# EAGLE design Team Scio Final Rev 3 (EAGLE 7.1.0)
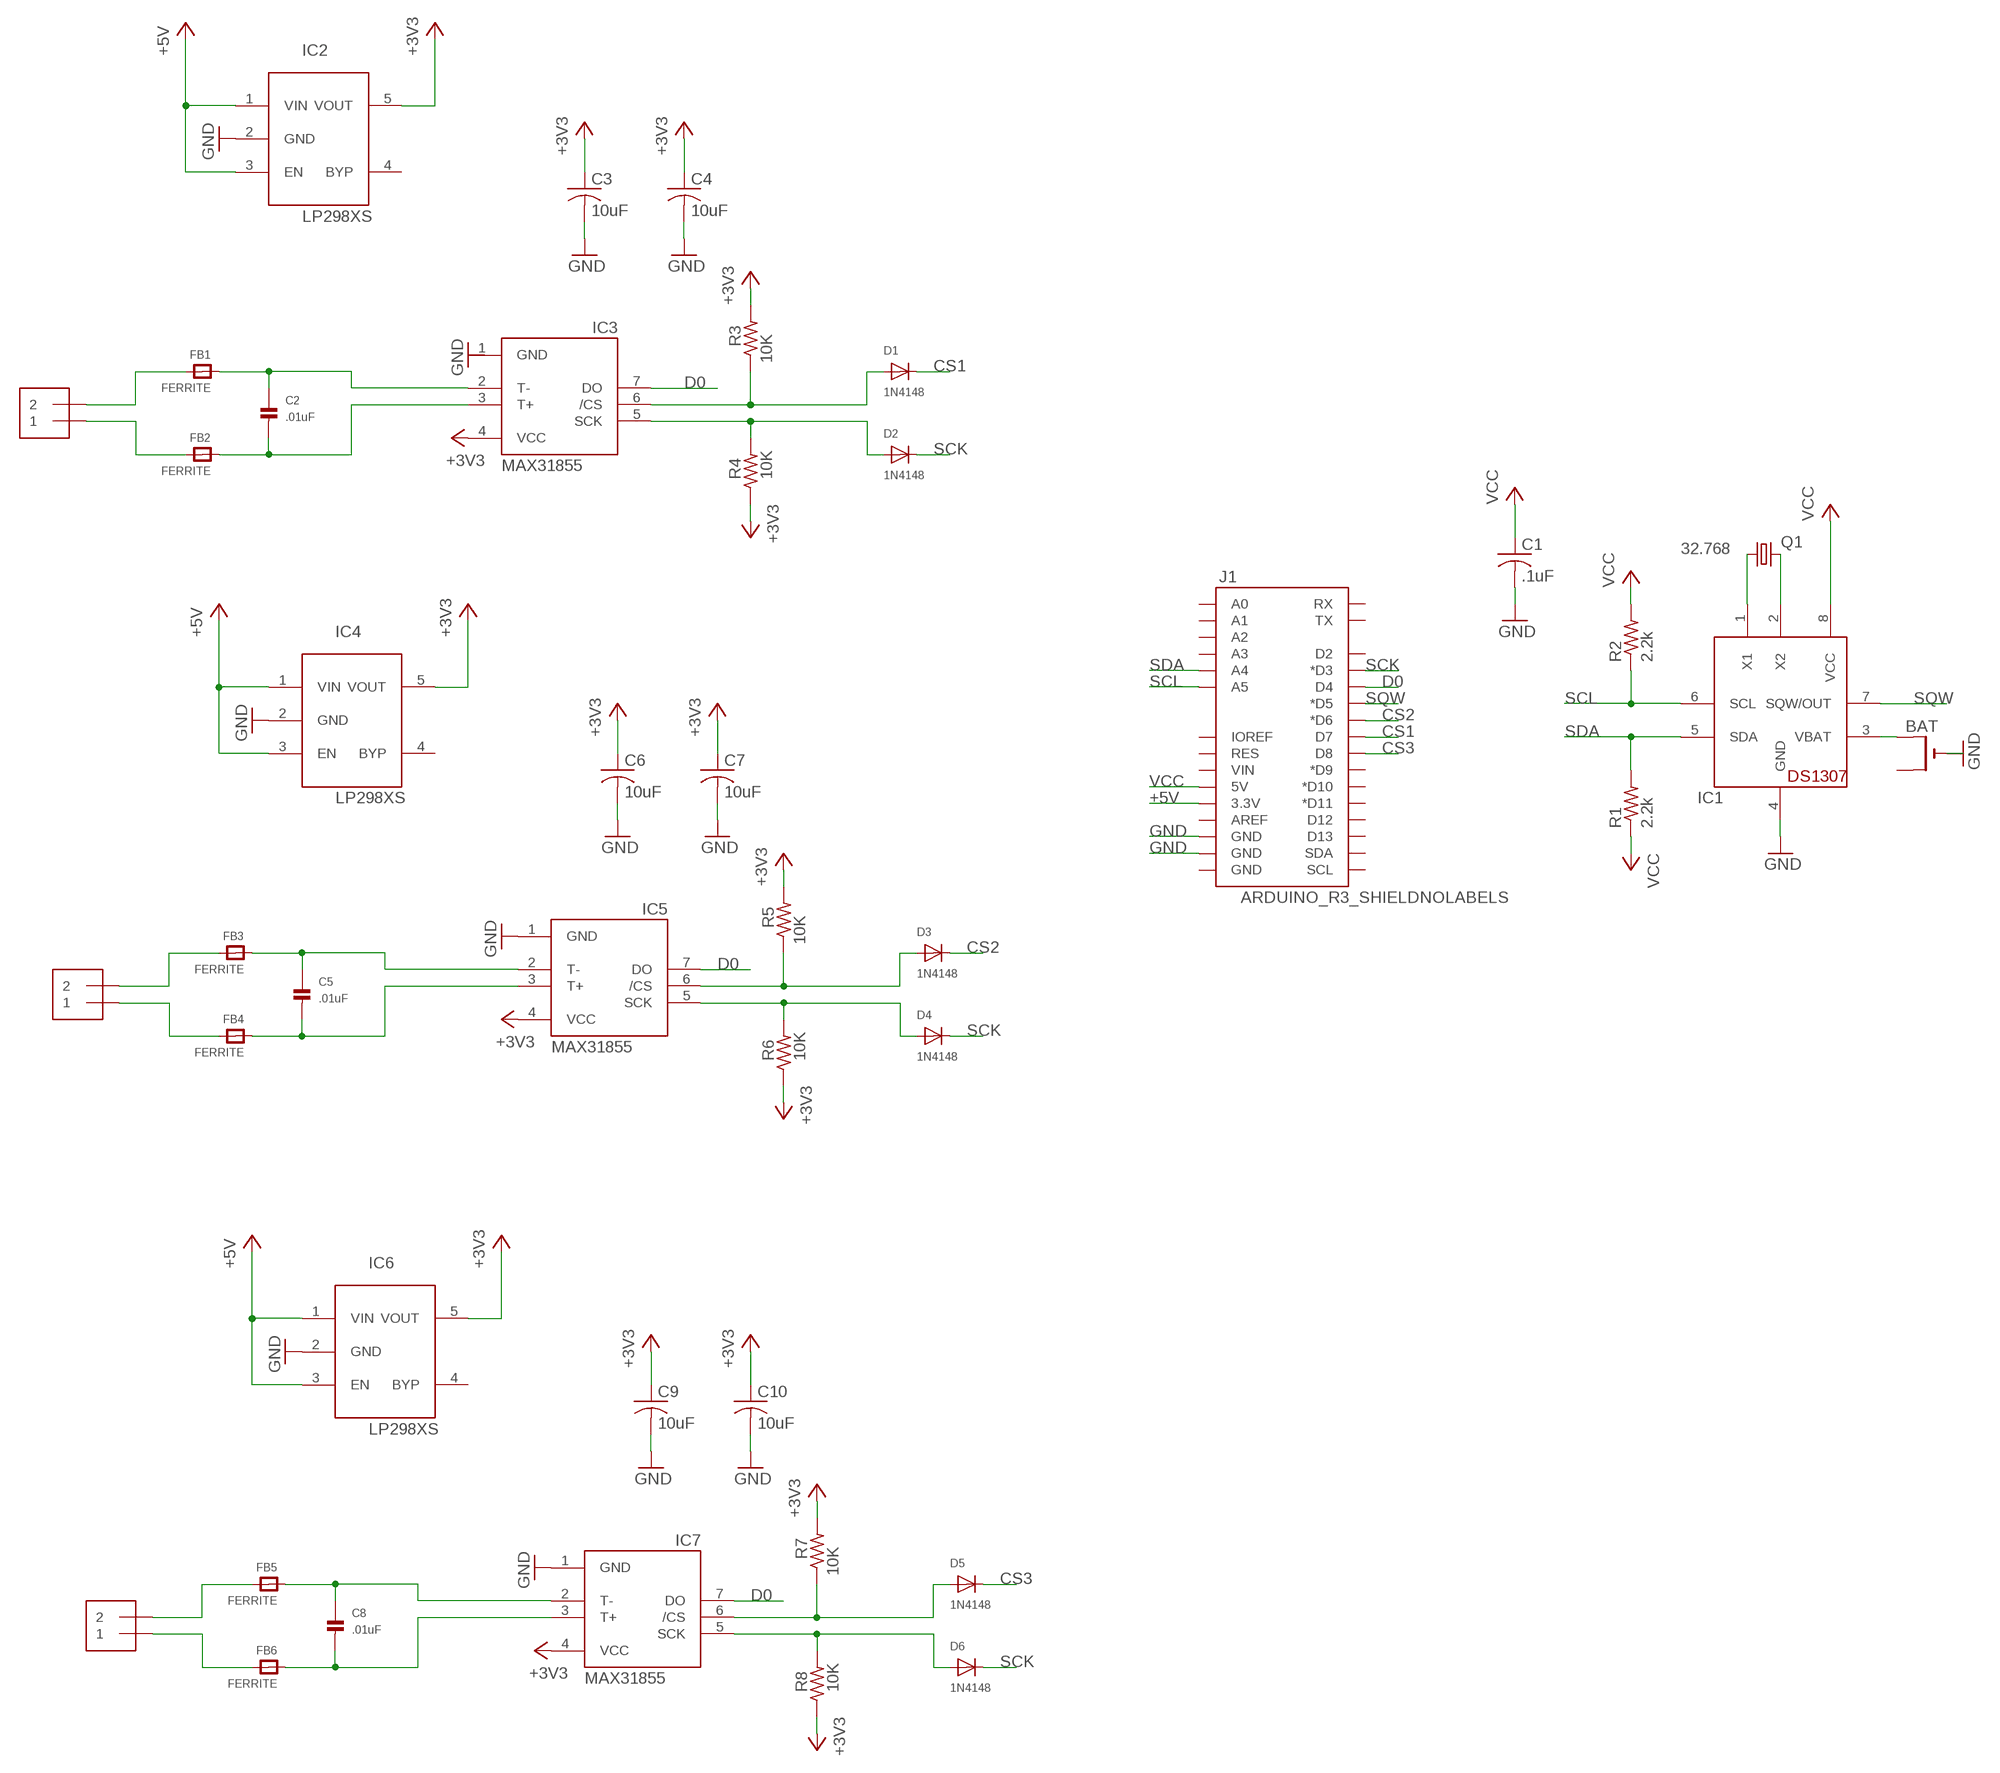
[diagram p0: schematic, sheet 1]

## Parts
C1  .1uF  C-US025-025X050  [C025-025X050]
C2  .01uF  CAP_CERAMIC0805  [0805]
C3  10uF  C-USC0805K  [C0805K]
C4  10uF  C-USC0805K  [C0805K]
C5  .01uF  CAP_CERAMIC0805  [0805]
C6  10uF  C-USC0805K  [C0805K]
C7  10uF  C-USC0805K  [C0805K]
C8  .01uF  CAP_CERAMIC0805  [0805]
C9  10uF  C-USC0805K  [C0805K]
C10  10uF  C-USC0805K  [C0805K]
D1  1N4148  DIODESOD-323F  [SOD-323F]
D2  1N4148  DIODESOD-323F  [SOD-323F]
D3  1N4148  DIODESOD-323F  [SOD-323F]
D4  1N4148  DIODESOD-323F  [SOD-323F]
D5  1N4148  DIODESOD-323F  [SOD-323F]
D6  1N4148  DIODESOD-323F  [SOD-323F]
FB1  FERRITE  FERRITE0805  [0805]
FB2  FERRITE  FERRITE0805  [0805]
FB3  FERRITE  FERRITE0805  [0805]
FB4  FERRITE  FERRITE0805  [0805]
FB5  FERRITE  FERRITE0805  [0805]
FB6  FERRITE  FERRITE0805  [0805]
IC1  DS1307  [DIL08]
IC2  LP298XS  [SOT23-5L]
IC3  MAX31855  MAX6675  [SO08]
IC4  LP298XS  [SOT23-5L]
IC5  MAX31855  MAX6675  [SO08]
IC6  LP298XS  [SOT23-5L]
IC7  MAX31855  MAX6675  [SO08]
J1  ARDUINO_R3_SHIELDNOLABELS  [UNO_R3_SHIELD_NOLABELS]
J2  J1  1X2-3.5MM  [1X2-3.5MM]
J3  1X2-3.5MM  [1X2-3.5MM]
J4  1X2-3.5MM  [1X2-3.5MM]
Q1  32.768  CRYSTALTC38H  [TC38H]
R1  2.2k  R-US_M1206  [M1206]
R2  2.2k  R-US_M1206  [M1206]
R3  10K  R-US_M1206  [M1206]
R4  10K  R-US_M1206  [M1206]
R5  10K  R-US_M1206  [M1206]
R6  10K  R-US_M1206  [M1206]
R7  10K  R-US_M1206  [M1206]
R8  10K  R-US_M1206  [M1206]
RTC  BAT  CR1220THM  [CR1220-THM]

## Nets
+3V3: C3.1 C4.1 C6.1 C7.1 C9.1 C10.1 IC2.5(VOUT) IC3.4(VCC) IC4.5(VOUT) IC5.4(VCC) IC6.5(VOUT) IC7.4(VCC) R3.2 R4.1 R5.2 R6.1 R7.2 R8.1
+5V: IC2.1(VIN) IC2.3(EN) IC4.1(VIN) IC4.3(EN) IC6.1(VIN) IC6.3(EN) J1.3.3V
CS1: D1.C J1.D7
CS2: D3.C J1.D6(*D6)
CS3: D5.C J1.D8
D0: IC3.7(DO) IC5.7(DO) IC7.7(DO) J1.D4
GND: C1.2 C3.2 C4.2 C6.2 C7.2 C9.2 C10.2 IC1.4(GND) IC2.2(GND) IC4.2(GND) IC5.1(GND) IC6.2(GND) IC7.1(GND) J1.GND@1(GND) J1.GND@2(GND) RTC.-
N$1: IC1.3(VBAT) RTC.+2(+1)
N$2: IC1.1(X1) Q1.1
N$3: IC1.2(X2) Q1.2
N$4: FB1.2 J2.2
N$5: FB2.2 J2.1
N$6: C2.1 FB1.1 IC3.2(T-)
N$7: C2.2 FB2.1 IC3.3(T+)
N$8: D1.A IC3.6(/CS) R3.1
N$9: D2.A IC3.5(SCK) R4.2
N$10: FB3.2 J3.2
N$11: FB4.2 J3.1
N$12: C5.1 FB3.1 IC5.2(T-)
N$13: C5.2 FB4.1 IC5.3(T+)
N$14: D3.A IC5.6(/CS) R5.1
N$15: D4.A IC5.5(SCK) R6.2
N$16: FB5.2 J4.2
N$17: FB6.2 J4.1
N$18: C8.1 FB5.1 IC7.2(T-)
N$19: C8.2 FB6.1 IC7.3(T+)
N$20: D5.A IC7.6(/CS) R7.1
N$21: D6.A IC7.5(SCK) R8.2
SCK: D2.C D4.C D6.C J1.D3(*D3)
SCL: IC1.6(SCL) J1.A5 R2.1
SDA: IC1.5(SDA) J1.A4 R1.2
SQW: IC1.7(SQW/OUT) J1.D5(*D5)
VCC: C1.1 IC1.8(VCC) J1.5V R1.1 R2.2
Unconnected: IC2.4(BYP) IC4.4(BYP) IC6.4(BYP) J1.A0 J1.A1 J1.A2 J1.A3 J1.AREF J1.D2 J1.D9(*D9) J1.D10(*D10) J1.D11(*D11) J1.D12 J1.D13 J1.GND@0(GND) J1.IOREF J1.RES J1.RX J1.SCL J1.SDA J1.TX J1.VIN RTC.+1(+)

## Power pins joined to a net without a drawn wire
GND: IC3.1(GND)

## Library data of the parts
C1 C3 C4 C6 C7 C9 C10 = adafruit:C-US: CAPACITOR, American symbol
C2 C5 C8 = microbuilder:CAP_CERAMIC: Ceramic Capacitors 0402 - 0402 Surface Mount Capacitors 16pF 50V 5% [Digikey: 445-4899-2-ND] 18pF 50V 5% [Digikey: 490-1281-2-ND] 22pF 50V 5% [Digikey: 490-1283-2-ND] 68pF 50V 5% [Digikey: 490-1289-2-ND] 0.1uF 10V 10% [Digikey: 490-1318-2-ND] 1.0uF 6.3V 10% [Digikey: 490-1320-2-ND] 0603 - 0603 Surface Mount Capacitors 16 pF 50V 5% [Digikey: 445-5051-2-ND] 22 pF 50V [Digikey: PCC220ACVTR-ND] 33 pF 50V 5% [Digikey: 490-1415-1-ND] 56pF 50V 5% [Digikey: 490-1421-1-ND] 220pF 50V 5% [Digikey: 445-1285-1-ND] 680 pF 50V 2200 pF 50V 5% C0G [Digikey: 445-1297-1-ND] 5600 pF 100V 5% X7R [Digikey: 478-3711-1-ND] 0.1 µF 25V 10% [Digikey: PCC2277TR-ND] 0.22 µF 16V 10% X7R [Digikey: 445-1318-1-ND] 1.0 µF 25V 10% [Digikey: 445-5146-2-ND] 0603 - RF Specific 3pF 250V +/-0.1pF RF [Digikey: 712-1347-1-ND] 18 pF 250V 5% [Digikey: 478-3505-1-ND or 712-1322-1-ND] 56 pF 250V 5% C0G RF [Digikey: 490-4867-1-ND] 68 pF 250V RF [Digikey: 490-4868-1-ND] 0805 - 0805 Surface Mount Capacitors 220 pF 250V 2% RF Ceramic Capacitor [Digikey: 712-1398-1-ND] 1000 pF 50V 2% NP0 Ceramic Capacitor [Digikey: 478-3760-1-ND] 0.1 µF 25V 10% Ceramic Capacitor [Digikey: PCC1828TR-ND] 1.0 µF 16V 10% Ceramic Capacitor[Digikey: 490-1691-2-ND] 10.0 µF 10V 10% Ceramic Capacitor[Digikey: 709-1228-1-ND] 10.0 uF 16V 10% Ceramic Capacitor [Digikey: 478-5165-2-ND] 47 uF 6.3V 20% Ceramic Capacitor [Digikey: 587-1779-1-ND or 399-5506-1-ND] 1206 - 1206 Surface Mount Capacitors 47uF 10V 20% Ceramic Capacitor [Digikey: 490-5528-1-ND or 399-5508-1-ND or 445-6010-1-ND] 100uF 6.3V -20%, +80% Y5V Ceramic Capacitor (Digikey: 490-4512-1-ND, Mouser: 81-GRM31CF50J107ZE1L)
D1-D6 = adafruit:DIODE: Diode SMADIODE - SMA Surface Mount Package 20V 1A Schottky Diode Digikey: 641-1014-6-ND DO-1N4148 - Through Hole Small Current Diode SOD-123 20V 1 A (.5mV Vf) Schottky Diode - Digikey: MBRX120TPMSCT-ND SOD-323 10V 570mA (.38mV Vf, 3ns) Schottky Diode - Digikey: ZLLS410CT-ND SOD-523 30V 30mA Schottky Diode (RB751S-40TE61) - Digikey: RB751S-40TE61CT-ND SOT23-R/W - SOT23 Package (R = Solder Paste/Reflow Ovens, W = Hand-Soldering) BAT54Film 40V 300mA - Digikey: 497-7162-1-ND
FB1-FB6 = microbuilder:FERRITE: Ferrite Bead 0603 MMZ1608B121C - 120 Ohm @ 100MHz, 600mA, 0.15 Ohm DC Resistance - Digikey: 445-2164-1-ND BK1608HW121-T - 120 Ohm, 600mA Ferrite Chip - Digikey: 587-1876-2-ND 0805 HZ0805B272R-10 - 2.7K Ohm @ 100MHz, 200mA, 0.8 Ohm DC Resistance - Digikey: 240-2504-1-ND (see also Murata BLM21BD272SN1L) MMZ2012Y152B - 1.5K Ohm @ 100MHz, 500mA, 0.4 Ohm DC Resistance - Digikey: 445-1560-1-ND - Mainly for high frequency (80-400MHz) MMZ2012R102A - 1K Ohm @ 100MHz, 500mA, 0.3 Ohm DC Resistance - Digikey: 445-1555-2-ND - More general purpose (10-200MHz)
IC1 = adafruit:DS1307: DS1307 Real time clock (RTC) with battery backup ability. Talk to it via i2c
IC2 IC4 IC6 = adafruit:LP298X
IC3 IC5 IC7 = adafruit:MAX6675
J1 = SparkFun-Boards:ARDUINO_R3_SHIELD: Shield form compatible with the Arduino Uno R3.
J2-J4 = adafruit:1X2: 3.5mm Terminal block http://www.ladyada.net/library/pcb/eaglelibrary.html
Q1 = crystal:CRYSTAL: CRYSTAL; OC_FARNELL: unknown; OC_NEWARK: unknown
R1 R2 = adafruit:R-US_: RESISTOR, American symbol
R3-R8 = resistor:R-US_: RESISTOR, American symbol
RTC = adafruit:CR1220: CR1216/CR1220/CR1225 12mm 3V lithium coin cell Great for battery packup. Both SMT and THM holders. Note the THM package has the ground pads on both sides of the PCB so that the masks are the same - this reduces the cost

## Net classes
0 default: width 0.305 mm, drill 0.508 mm, clearance 0.254 mm

## Board
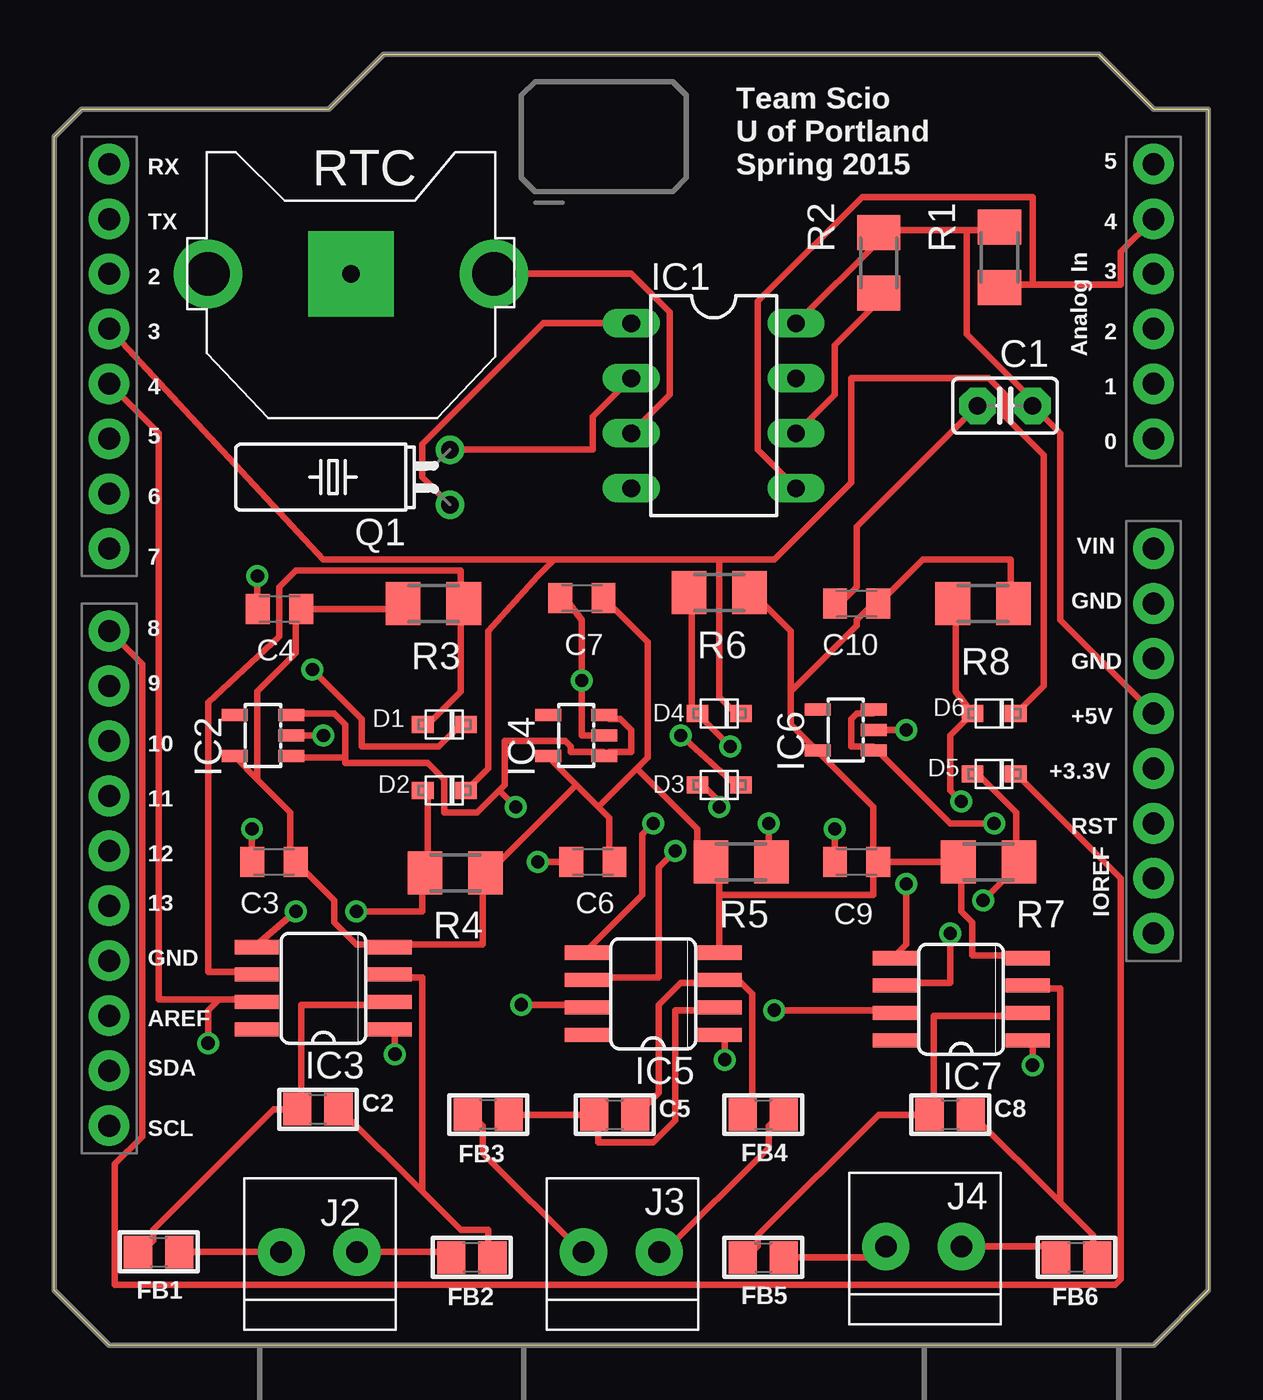
[diagram p1: board, top side]
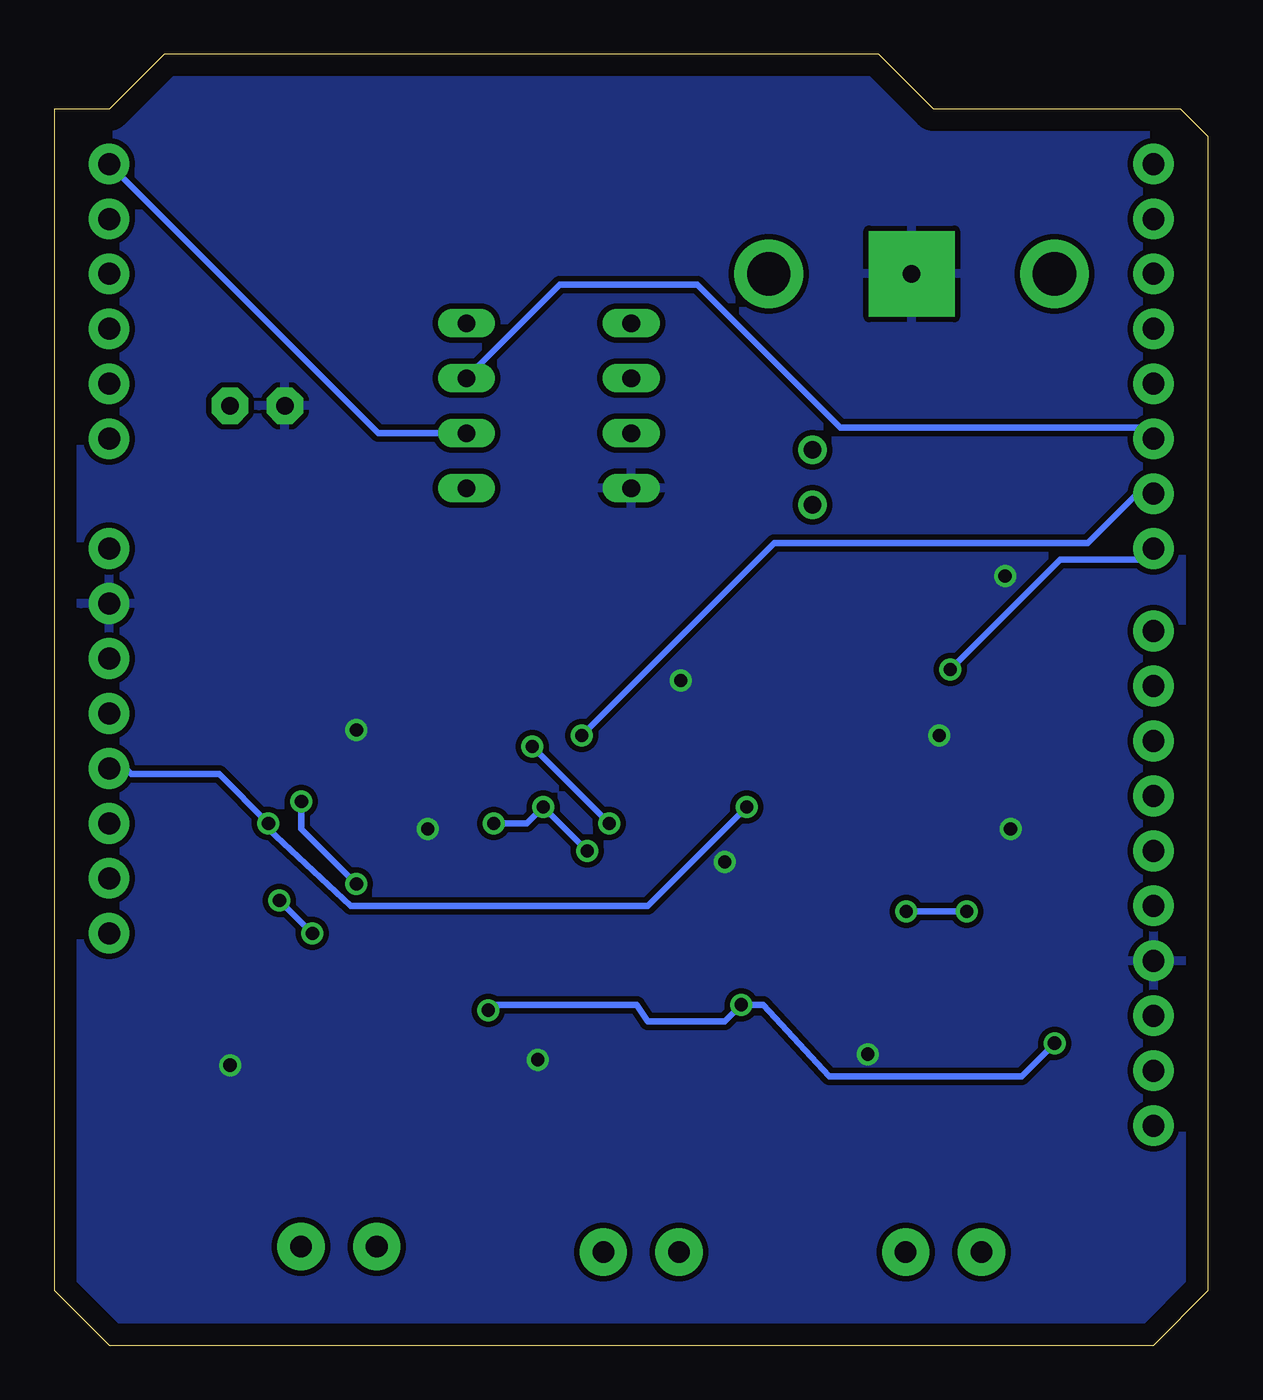
[diagram p2: board, bottom side, seen from below]

Size 53.34 x 59.69 mm. Coordinates in mm from the lower left corner, seen from the top.
Outline: 0,55.88 1.27,57.15 12.7,57.15 15.24,59.69 48.26,59.69 50.8,57.15 53.34,57.15 53.34,2.54 50.8,0 2.54,0 0,2.54 0,55.88
Copper layers (1*16): Top 0.035mm / dielectric 1.5mm / Bottom 0.035mm
Design rules "default": minimum track width 10mil, minimum drill 24mil, track to track 8mil, track to pad 8mil, pad to pad 8mil, via to via 8mil, smd to smd 8mil, copper to edge 40mil, drill to drill 8mil, minimum pad ring 10mil, minimum via ring 8mil, stop-mask expansion 4mil, vias tented up to drill 0mil, thermal gap 10mil

### Footprints (pad centres in the part's own frame; a part is rotated, then mirrored left to right if it is on the bottom)
C025-025X050 = drill 0.813 pad 1.676 octagon: 1 -1.27,0; 2 1.27,0
0805 = smd 1.3 x 1.5: 1 -0.95,0; 2 0.95,0
C0805K = smd 1.1 x 1.4: 1 -1,0; 2 1,0
SOD-323F = smd 1 x 0.8: A -1,0; C 1,0
DIL08 = drill 0.813 long: 1 -3.81,-3.81; 2 -1.27,-3.81; 3 1.27,-3.81; 4 3.81,-3.81; 5 3.81,3.81; 6 1.27,3.81; 7 -1.27,3.81; 8 -3.81,3.81
SOT23-5L = smd 0.55 x 1.2: 1 -0.95,-1.3; 2 0,-1.3; 3 0.95,-1.3; 4 0.95,1.3; 5 -0.95,1.3
SO08 = smd 0.66 x 2.032: 1 -1.905,-3.073; 2 -0.635,-3.073; 3 0.635,-3.073; 4 1.905,-3.073; 5 1.905,3.073; 6 0.635,3.073; 7 -0.635,3.073; 8 -1.905,3.073
UNO_R3_SHIELD_NOLABELS = drill 1.016 pad 1.88: 3.3V 50.8,26.67; 5V 50.8,29.21; A0 50.8,41.91; A1 50.8,44.45; A2 50.8,46.99; A3 50.8,49.53; A4 50.8,52.07; A5 50.8,54.61; AREF 2.54,15.24; D2 2.54,49.53; D3 2.54,46.99; D4 2.54,44.45; D5 2.54,41.91; D6 2.54,39.37; D7 2.54,36.83; D8 2.54,33.02; D9 2.54,30.48; D10 2.54,27.94; D11 2.54,25.4; D12 2.54,22.86; D13 2.54,20.32; GND@0 50.8,31.75; GND@1 50.8,34.29; GND@2 2.54,17.78; IOREF 50.8,21.59; NC 50.8,19.05; RES 50.8,24.13; RX 2.54,54.61; SCL 2.54,10.16; SDA 2.54,12.7; TX 2.54,52.07; VIN 50.8,36.83
1X2-3.5MM = drill 1 pad 2.184: 1 1.8,0; 2 -1.7,0
TC38H = drill 0.813: 1 -1.27,0; 2 1.27,0
M1206 = smd 1.6 x 2: 1 -1.4,0; 2 1.4,0
CR1220-THM = drill 2 pad 3.175: +1 -6.604,0; +2 6.604,0 | drill 0.8 pad 3.962 square: - 0,0

### Placement (x,y rotation side)
C1  43.94,43.43 180 top
C2  12.19,10.92 0 top
C3  10.16,22.35 180 top
C4  10.41,34.04 180 top
C5  25.91,10.67 0 top
C6  24.89,22.35 180 top
C7  24.38,34.54 180 top
C8  41.4,10.67 0 top
C9  37.08,22.35 180 top
C10  37.08,34.29 180 top
D1  18.03,28.7 0 top
D2  18.03,25.65 0 top
D3  30.73,25.91 0 top
D4  30.73,29.21 0 top
D5  43.43,26.42 0 top
D6  43.43,29.21 0 top
FB1  4.83,4.32 0 top
FB2  19.3,4.06 180 top
FB3  20.07,10.67 180 top
FB4  32.77,10.67 0 top
FB5  32.77,4.06 0 top
FB6  47.24,4.06 180 top
IC1  30.48,43.43 270 top
IC2  9.65,28.19 90 top
IC3  12.45,16.51 90 top
IC4  24.13,28.19 90 top
IC5  27.69,16.26 90 top
IC6  36.58,28.45 90 top
IC7  41.91,16 90 top
J1  0,0 0 top
J2  12.19,4.32 0 top
J3  26.16,4.32 0 top
J4  40.13,4.57 0 top
Q1  18.29,40.13 90 top
R1  43.69,50.29 270 top
R2  38.1,50.04 90 top
R3  17.53,34.29 180 top
R4  18.54,21.84 180 top
R5  31.75,22.35 180 top
R6  30.73,34.8 180 top
R7  43.18,22.35 180 top
R8  42.93,34.29 180 top
RTC  13.72,49.53 0 top

### Tracks (layer width: path | path; a pad name or v marks a point on that pad's centre or on a via)
+3V3
  Top 0.305: R8.1 44.2,34.29 44.2,36.32 40.13,36.32 38.1,34.29 C10.1 37.85,34.29 37.08,33.53 37.08,33.27 34.04,30.23 | 30.73,20.83 30.73,18.29 IC5.4 | 30.73,20.83 30.73,22.1 30.48,22.35 R5.2 30.23,22.35 29.72,22.86 29.72,23.88 26.92,26.67 | 37.85,22.35 37.85,24.89 35.31,27.43 IC6.5 35.05,27.69 34.04,28.7 34.04,30.23 | 34.04,30.23 34.04,33.02 32.26,34.8 R6.1 | IC7.4 44.96,18.03 42.42,18.03 42.42,19.56 41.91,20.07 41.91,22.35 R7.2 C9.1 37.85,22.35 | 30.73,20.83 37.85,20.83 37.85,22.35 | R3.2 16,34.29 16,34.04 C4.1 11.18,34.04 11.18,32 9.4,30.23 9.4,26.16 | 9.4,26.16 10.92,24.64 10.92,22.35 C3.1 11.18,22.35 12.95,20.57 12.95,19.56 13.97,18.54 15.49,18.54 IC3.4 15.75,18.54 19.81,18.54 19.81,21.84 R4.1 20.07,21.84 24.13,25.91 | 9.4,26.16 8.38,27.18 IC2.5 | 25.15,24.89 25.65,24.38 25.65,22.35 C6.1 | 25.15,24.89 24.13,25.91 | 24.13,25.91 22.86,27.18 IC4.5 | 25.15,24.89 26.92,26.67 | 26.92,26.67 27.43,27.18 27.43,32.51 25.4,34.54 C7.1
+5V  (via drill 0.61)
  Top 0.305: IC4.3 25.65,28.96 26.16,28.96 26.67,28.45 26.67,27.43 25.65,27.43 IC4.1 25.4,27.43 23.88,27.43 23.88,27.69 23.62,27.94 20.83,27.94 20.83,25.91 20.57,25.65 | 13.46,27.18 11.18,27.18 IC2.1 | 13.46,27.18 13.46,28.7 12.95,29.21 11.18,29.21 IC2.3 | 20.57,25.65 19.56,24.64 18.03,24.64 18.03,26.16 17.27,26.92 13.46,26.92 13.46,27.18 | IC6.3 37.85,29.21 37.08,29.21 36.83,28.96 36.83,27.69 37.85,27.69 IC6.1 38.1,27.43 41.4,24.13 v43.43,24.13 | v21.34,24.89 20.57,25.65
  Bottom 0.305: J1.3.3V 50.04,26.67 49.78,26.42 45.72,26.42 v43.43,24.13 43.43,23.88 39.62,20.32 25.91,20.32 v21.34,24.89
CS1  (via drill 0.61)
  Top 0.305: v11.94,31.24 14.22,28.96 14.22,27.69 17.78,27.69 18.8,28.7 D1.C
  Bottom 0.305: v11.94,31.24 6.86,36.32 3.05,36.32 J1.D7
CS2  (via drill 0.61)
  Top 0.305: v28.96,28.19 31.5,25.91 D3.C
  Bottom 0.305: v28.96,28.19 20.07,37.08 5.59,37.08 3.3,39.37 J1.D6
CS3
  Top 0.305: J1.D8 4.06,31.5 4.06,9.65 2.79,8.38 2.79,2.79 49.02,2.79 49.28,3.05 49.28,21.59 44.45,26.42 D5.C
D0  (via drill 0.61)
  Top 0.305: v33.27,15.49 38.61,15.49 IC7.7 | 24.64,15.75 IC5.7 24.61,15.75 v21.59,15.75 | 7.62,16 4.83,16 4.83,42.16 J1.D4 | 7.62,16 9.14,16 IC3.7 9.4,16 10.16,16 | v7.11,13.97 7.11,15.49 7.62,16
  Bottom 0.305: v33.27,15.49 33.02,15.75 26.42,15.75 25.91,14.99 22.35,14.99 v21.59,15.75 20.57,15.75 17.53,12.45 8.64,12.45 v7.11,13.97
GND  (via drill 0.61)
  Top 0.305: IC4.2 24.38,28.19 v24.38,30.73 24.38,33.53 23.62,34.54 C7.2 | v12.45,28.19 IC2.2 | v39.37,28.45 IC6.2 | v9.14,23.88 9.14,22.35 C3.2 | v9.4,35.56 9.4,34.04 C4.2 | v22.35,22.35 C6.2 | v36.07,23.88 36.07,22.35 C9.2 | C1.2 37.08,37.85 37.08,35.05 36.32,34.29 C10.2 | v15.75,13.46 15.75,14.48 IC3.1 | v30.99,13.21 30.99,14.22 IC5.1 | v45.21,12.95 45.21,13.97 IC7.1
  pour Bottom: -1.27,61.21 53.85,61.21 54.61,-2.29 -1.78,-2.29
N$1
  Top 0.305: IC1.3 28.45,43.94 28.45,47.75 26.67,49.53 RTC.+2
N$2
  Top 0.305: Q1.1 17.02,40.13 17.02,41.66 22.61,47.24 IC1.1
N$3
  Top 0.305: Q1.2 24.89,41.4 24.89,42.93 IC1.2
N$4
  Top 0.305: J2.2 FB1.2
N$5
  Top 0.305: 18.1,4.32 FB2.2 18.03,4.32 J2.1
N$6
  Top 0.305: FB1.1 4.06,4.32 4.57,4.83 4.57,5.33 10.16,10.92 C2.1 11.43,10.92 11.43,15.75 15.49,15.75 IC3.2
N$7
  Top 0.305: 17.02,7.11 18.8,5.33 20.07,5.33 20.07,4.06 FB2.1 | 17.02,7.11 13.21,10.92 C2.2 | 17.02,7.11 17.02,17.02 15.75,17.02 IC3.3
N$8
  Top 0.305: 18.8,34.29 18.8,30.23 17.27,28.7 D1.A | 18.8,34.29 18.8,35.81 11.18,35.81 10.41,35.05 10.41,32.77 7.11,29.72 7.11,17.27 9.14,17.27 IC3.6 | 18.8,34.29 R3.1
N$9  (via drill 0.61)
  Top 0.305: D2.A 17.27,25.65 17.27,21.84 R4.2 17.02,21.84 17.02,20.07 v13.97,20.07 | v11.18,20.07 9.4,18.54 IC3.5
  Bottom 0.305: v13.97,20.07 v11.18,20.07
N$10
  Top 0.305: FB3.2 19.3,10.67 19.81,10.16 19.81,8.89 24.38,4.32 J3.2
N$11
  Top 0.305: FB4.2 33.53,10.67 33.02,10.16 33.02,9.14 28.19,4.32 J3.1
N$12
  Top 0.305: FB3.1 C5.1 25.15,10.67 25.15,9.4 27.69,9.4 28.7,10.41 28.7,15.49 30.73,15.49 IC5.2
N$13
  Top 0.305: C5.2 26.92,10.67 27.94,11.68 27.94,15.75 28.96,16.76 30.73,16.76 IC5.3 30.99,16.76 31.75,16.76 32.26,16.26 32.26,10.92 32,10.67 FB4.1
N$14  (via drill 0.61)
  Top 0.305: v30.73,24.89 30.73,25.15 29.97,25.91 D3.A | v33.02,24.13 33.02,22.35 R5.1 | v28.7,22.86 27.94,22.1 27.94,17.02 24.64,17.02 IC5.6
  Bottom 0.305: v33.02,24.13 31.5,24.13 v30.73,24.89 v28.7,22.86
N$15  (via drill 0.61)
  Top 0.305: R6.2 29.46,34.8 29.46,29.46 29.72,29.21 D4.A 29.97,29.21 29.97,28.96 v31.24,27.69 | v27.69,24.13 27.18,23.62 27.18,20.83 24.64,18.29 IC5.5
  Bottom 0.305: v31.24,27.69 v27.69,24.13
N$16
  Top 0.305: FB5.2 38.35,4.06 38.35,4.57 J4.2
N$17
  Top 0.305: 45.79,4.57 FB6.2 45.72,4.57 J4.1
N$18
  Top 0.305: 32,4.06 32.51,4.57 32.51,5.08 38.1,10.67 C8.1 40.64,10.67 40.64,15.24 44.96,15.24 IC7.2
  Top 0.406: FB5.1 32,4.06
N$19
  Top 0.305: 46.48,6.6 48.01,5.08 48.01,4.06 FB6.1 | 46.48,6.6 42.42,10.67 C8.2 | 46.48,6.6 46.48,16.51 45.21,16.51 IC7.3
N$20  (via drill 0.61)
  Top 0.305: 44.45,22.35 44.45,24.64 42.67,26.42 D5.A | v41.4,19.05 41.4,16.76 38.86,16.76 IC7.6 | v42.93,20.57 44.45,22.1 44.45,22.35 | 44.45,22.35 R7.1
  Bottom 0.305: v42.93,20.57 v41.4,19.05
N$21  (via drill 0.61)
  Top 0.305: 42.42,29.21 41.66,30.23 41.66,34.29 R8.2 | v39.37,21.34 39.37,18.54 38.86,18.03 IC7.5 | v41.91,25.15 41.4,25.65 41.4,28.19 42.42,29.21 | 42.42,29.21 D6.A
  Bottom 0.305: v39.37,21.34 41.91,23.88 v41.91,25.15
SCK
  Top 0.305: 23.11,36.32 22.35,35.56 20.07,33.02 20.07,26.67 19.05,25.65 D2.C | 30.73,36.32 23.11,36.32 | 30.73,36.32 30.73,29.97 31.5,29.21 D4.C | 30.73,36.32 33.27,36.32 36.83,39.88 36.83,44.7 43.18,44.7 43.94,43.94 43.94,42.93 45.72,41.15 45.72,30.48 44.45,29.21 D6.C | J1.D3 12.45,36.32 23.11,36.32
SCL
  Top 0.305: IC1.6 36.07,43.94 36.07,46.23 38.1,48.26 R2.1
  Bottom 0.305: J1.A5 38.35,42.16 IC1.6
SDA
  Top 0.305: 45.21,49.02 49.28,49.02 49.28,50.55 J1.A4 | 45.21,49.02 43.69,49.02 R1.2 | IC1.5 32.51,41.4 32.51,48.26 37.34,53.09 45.21,53.09 45.21,49.02
SQW
  Bottom 0.305: IC1.7 29.97,49.02 23.62,49.02 17.02,42.42 3.05,42.42 J1.D5
VCC
  Top 0.305: J1.5V 46.48,33.53 46.48,42.16 C1.1 45.21,43.69 42.16,46.74 42.16,51.56 | 42.16,51.56 43.69,51.56 R1.1 | 42.16,51.56 38.1,51.56 R2.2 38.1,51.05 IC1.8

### Text on the board
tPlace: RX | Team Scio / U of Portland / Spring 2015 | 5 | TX | 4 | 2 | 3 | 3 | Analog In | 2 | 4 | 1 | 5 | 0 | 6 | VIN | 7 | GND | 8 | GND | 9 | +5V | 10 | +3.3V | 11 | RST | 12 | 13 | IOREF | GND | AREF | SDA | SCL